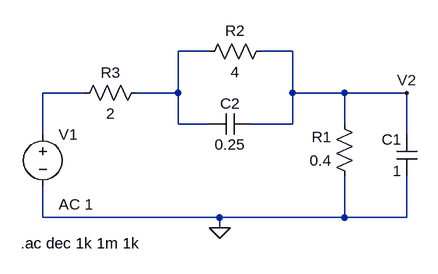
[diagram p0: schematic Ej2_Y22.asc]
Ej2_Y22.asc, the LTspice schematic file:
Version 4
SHEET 1 880 680
WIRE 160 80 112 80
WIRE 288 80 240 80
WIRE -32 144 -96 144
WIRE 112 144 112 80
WIRE 112 144 48 144
WIRE 288 144 288 80
WIRE 368 144 288 144
WIRE 464 144 368 144
WIRE 112 192 112 144
WIRE 160 192 112 192
WIRE 288 192 288 144
WIRE 288 192 224 192
WIRE 368 192 368 144
WIRE -96 208 -96 144
WIRE 464 208 464 144
WIRE -96 336 -96 288
WIRE 176 336 -96 336
WIRE 368 336 368 272
WIRE 368 336 176 336
WIRE 464 336 464 272
WIRE 464 336 368 336
WIRE 176 352 176 336
FLAG 176 352 0
FLAG 464 144 V2
SYMBOL res 64 128 R90
WINDOW 0 0 56 VBottom 2
WINDOW 3 32 56 VTop 2
SYMATTR InstName R3
SYMATTR Value 2
SYMBOL res 256 64 R90
WINDOW 0 0 56 VBottom 2
WINDOW 3 32 56 VTop 2
SYMATTR InstName R2
SYMATTR Value 4
SYMBOL res 384 288 R180
WINDOW 0 36 76 Left 2
WINDOW 3 36 40 Left 2
SYMATTR InstName R1
SYMATTR Value 0.4
SYMBOL cap 224 176 R90
WINDOW 0 0 32 VBottom 2
WINDOW 3 32 32 VTop 2
SYMATTR InstName C2
SYMATTR Value 0.25
SYMBOL cap 480 272 R180
WINDOW 0 24 56 Left 2
WINDOW 3 24 8 Left 2
SYMATTR InstName C1
SYMATTR Value 1
SYMBOL voltage -96 192 R0
WINDOW 123 24 124 Left 2
WINDOW 39 0 0 Left 0
SYMATTR InstName V1
SYMATTR Value ""
SYMATTR Value2 AC 1
TEXT -130 376 Left 2 !.ac dec 1k 1m 1k

The netlist it stands for:
* Ej2_Y22.asc
R3 N001 N002 2
R2 V2 N001 4
R1 0 V2 0.4
C2 V2 N001 0.25
C1 0 V2 1
V1 N002 0 AC 1
.ac dec 1k 1m 1k
.backanno
.end